# Altium project StationSolPortative.PrjPcb
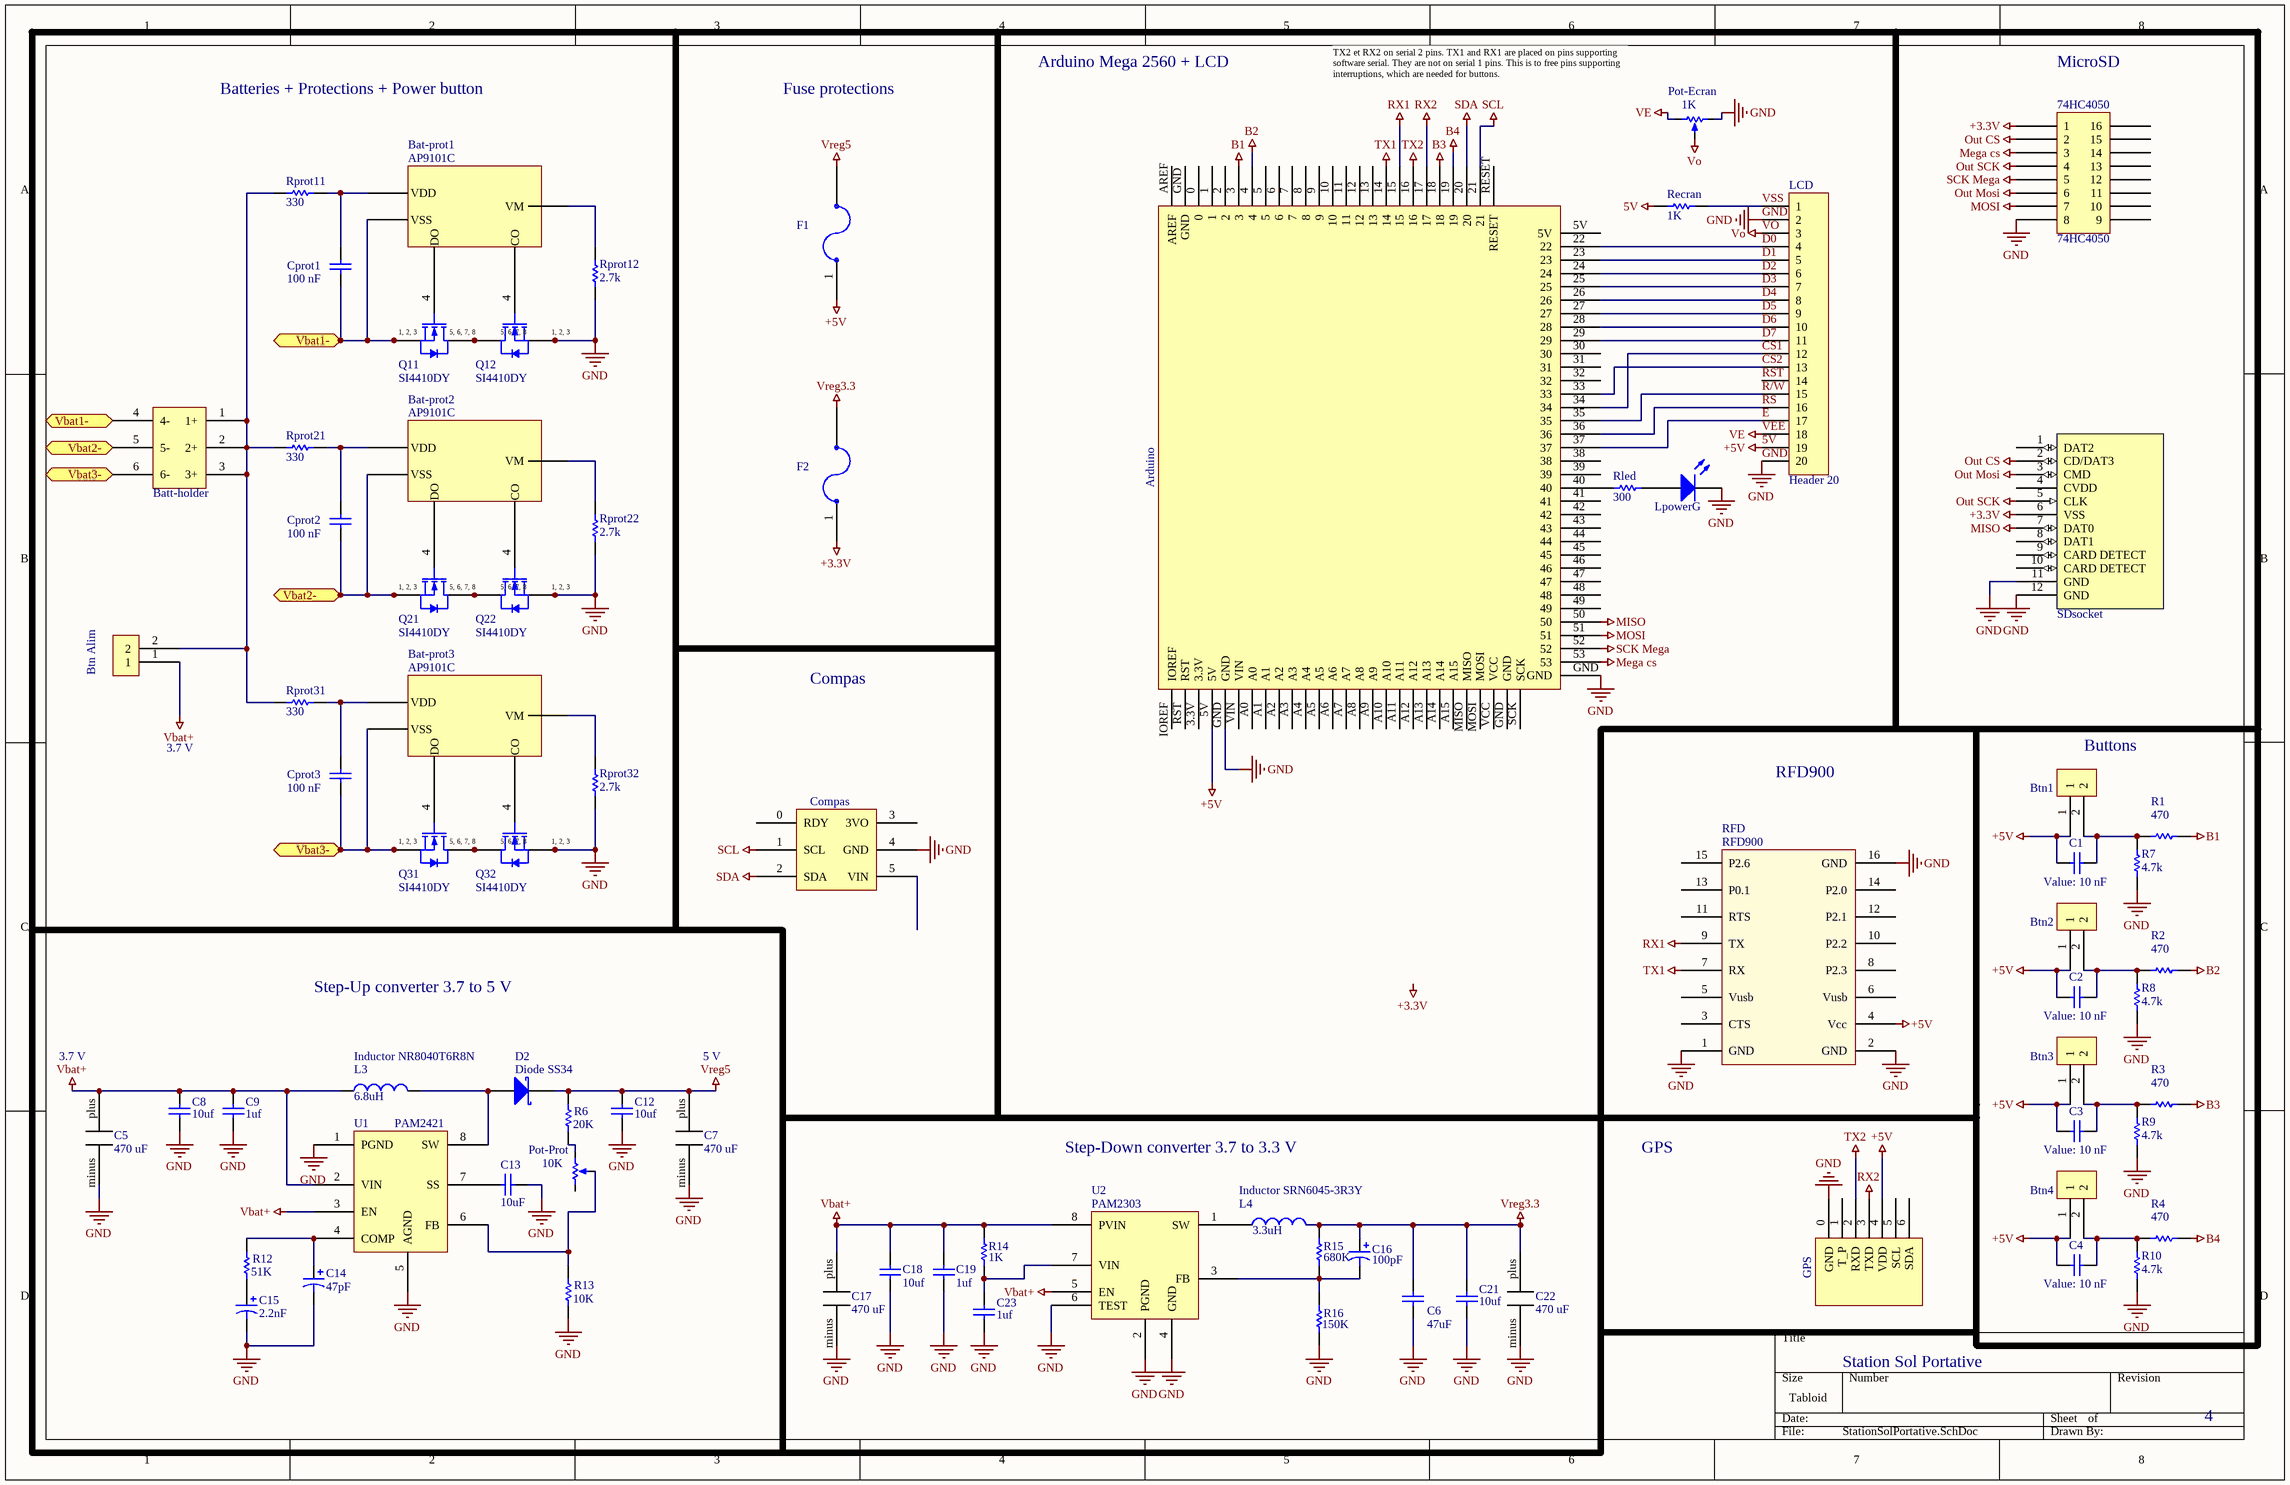
[diagram p0: StationSolPortative.SchDoc]
1 sheet, 77 parts. Net scope: flat (ports and power ports of the same name join across sheets).
Board file: StationSolPortative.PcbDoc

## Sheet StationSolPortative.SchDoc
size Tabloid

### Parts
74HC4050  74HC4050  [DIP16_74HC4050]
Arduino  ArduinoMega2560  [ArduinoMega2560]  (value not drawn)
Bat-prot1  AP9101C  [SOT26]
Bat-prot2  AP9101C  [SOT26]
Bat-prot3  AP9101C  [SOT26]
Batt-holder  BH-BK-18650-PC6-ND  [BH-BK-18650-PC6-ND]  (value not drawn)
Btn1  MAT100_2PINS  [MTA100_2PINS]  (value not drawn)
Btn2  MAT100_2PINS  [MTA100_2PINS]  (value not drawn)
Btn3  MAT100_2PINS  [MTA100_2PINS]  (value not drawn)
Btn4  MAT100_2PINS  [MTA100_2PINS]  (value not drawn)
Btn_Alim  MAT100_2PINS  [MTA100_2PINS]  (value not drawn)
C1  10 nF  [CAP 0805 - N]
C2  10 nF  [CAP 0805 - N]
C3  10 nF  [CAP 0805 - N]
C4  10 nF  [CAP 0805 - N]
C5  470 uF  [Gros condensateur]
C6  value 47uF  [C1210]  (hidden comment: Cap Semi)
C7  470 uF  [Gros condensateur]
C8  10uf  [CAP 0805 - N]
C9  1uf  [CAP 0805 - N]
C12  10uf  [CAP 0805 - N]
C13  10uF  [CAP 0805 - N]
C14  value 47pF  [CAP 0805 - N]  (hidden comment: Cap Pol1)
C15  value 2.2nF  [CAP 0805 - N]  (hidden comment: Cap Pol1)
C16  value 100pF  [CAP 0805 - N]  (hidden comment: Cap Pol1)
C17  470 uF  [Gros condensateur]
C18  10uf  [CAP 0805 - N]
C19  1uf  [CAP 0805 - N]
C21  10uf  [CAP 0805 - N]
C22  470 uF  [Gros condensateur]
C23  1uf  [CAP 0805 - N]
Compas  HMC5883L  [HMC5883L]  (value not drawn)
Cprot1  100 nF  [CAP 0805 - N]
Cprot2  100 nF  [CAP 0805 - N]
Cprot3  100 nF  [CAP 0805 - N]
D2  Diode SS34  [Diode]
F1  Fuse  [Fuse Holder 3mm]  (value not drawn)
F2  Fuse  [Fuse Holder 3mm]  (value not drawn)
gps  GPS  [PAM-7Q GPS]
L3  Inductor NR8040T6R8N  value 6.8uH  [Inductance 6.8uH]
L4  Inductor SRN6045-3R3Y  value 3.3uH  [Inductance]
LCD  Header 20  [HDR2X10]
LpowerG  LED 1206  [LED - 1206]  (value not drawn)
Pot-Ecran  value 1K  [Trim 67WR]  (hidden comment: Res Pot)
Pot-Prot  value 10K  [Trim 67WR]  (hidden comment: Res Pot)
Q11  SI4410DY  [SO-8_N]
Q12  SI4410DY  [SO-8_N]
Q21  SI4410DY  [SO-8_N]
Q22  SI4410DY  [SO-8_N]
Q31  SI4410DY  [SO-8_N]
Q32  SI4410DY  [SO-8_N]
R1  value 470  [Res 0805 - N]  (hidden comment: Res smd)
R2  value 470  [Res 0805 - N]  (hidden comment: Res smd)
R3  value 470  [Res 0805 - N]  (hidden comment: Res smd)
R4  value 470  [Res 0805 - N]  (hidden comment: Res smd)
R6  value 20K  [Res 0805 - N]  (hidden comment: Res1)
R7  value 4.7k  [Res 0805 - N]  (hidden comment: Res smd)
R8  value 4.7k  [Res 0805 - N]  (hidden comment: Res smd)
R9  value 4.7k  [Res 0805 - N]  (hidden comment: Res smd)
R10  value 4.7k  [Res 0805 - N]  (hidden comment: Res smd)
R12  value 51K  [Res 0805 - N]  (hidden comment: Res1)
R13  value 10K  [Res 0805 - N]  (hidden comment: Res1)
R14  value 1K  [Res 0805 - N]  (hidden comment: Res1)
R15  value 680K  [Res 0805 - N]  (hidden comment: Res1)
R16  value 150K  [Res 0805 - N]  (hidden comment: Res1)
Recran  value 1K  [Res 0805 - N]  (hidden comment: Res smd)
RFD  Component_1  [RFD900]  (value not drawn)
Rled  value 300  [Res 0805 - N]  (hidden comment: Res smd)
Rprot11  value 330  [Res 0805 - N]  (hidden comment: Res smd)
Rprot12  value 2.7k  [Res 0805 - N]  (hidden comment: Res smd)
Rprot21  value 330  [Res 0805 - N]  (hidden comment: Res smd)
Rprot22  value 2.7k  [Res 0805 - N]  (hidden comment: Res smd)
Rprot31  value 330  [Res 0805 - N]  (hidden comment: Res smd)
Rprot32  value 2.7k  [Res 0805 - N]  (hidden comment: Res smd)
SDsocket  Carte micro SD  [Carte SD]  (value not drawn)
U1  PAM2421  [SOP8]
U2  Name: PAM2303  [SOP8]  (hidden comment: PAM2320)

### Blocks framed on the sheet
Batteries + Protections + Power button: Bat-prot1-Bat-prot3 Batt-holder Btn_Alim Cprot1-Cprot3 Q11 Q12 Q21 Q22 Q31 Q32 Rprot11 Rprot12 Rprot21 Rprot22 Rprot31 Rprot32
Fuse protections: F1 F2
MicroSD: 74HC4050 SDsocket
RFD900: RFD
Buttons: Btn1-Btn4 C1-C4 R1-R4 R7-R10
Step-Up converter 3.7 to 5 V: C5 C7-C9 C12-C15 D2 L3 Pot-Prot R6 R12 R13 U1
Step-Down converter 3.7 to 3.3 V: C6 C16-C19 C21-C23 L4 R14-R16 U2

### Ports
Vbat1-, Vbat2-, Vbat3-

### Nets
5V: Arduino.5V Btn1.1 Btn2.1 Btn3.1 Btn4.1 C1.1 C2.1 C3.1 C4.1 F1.1 gps.4(VDD) LCD.19 Recran.1 RFD.4(Vcc)  [also labelled +5V]
+3.3V: 74HC4050.1 F2.1 SDsocket.6(VSS)
B1: Arduino.3 R1.1
B2: Arduino.4 R2.1
B3: Arduino.18 R3.1
B4: Arduino.19 R4.1
GND: 74HC4050.8 Arduino.GND C5.minus C6.1 C7.minus C8.1 C9.1 C12.1 C13.1 C14.2 C15.2 C17.minus C18.1 C19.1 C21.1 C22.minus C23.1 Compas.4(GND) gps.0(GND) LCD.2 LCD.20 LpowerG.2 Pot-Ecran.3(Bot) Q12.1(S) Q12.2(S) Q12.3(S) Q22.1(S) Q22.2(S) Q22.3(S) Q32.1(S) Q32.2(S) Q32.3(S) R7.1 R8.1 R9.1 R10.1 R13.1 R16.1 RFD.1(GND) RFD.2(GND) RFD.16(GND) Rprot12.1 Rprot22.1 Rprot32.1 SDsocket.11(GND) SDsocket.12(GND) U1.1(PGND) U1.5(AGND) U2.2(PGND) U2.4(GND) U2.6(TEST)
Mega cs: 74HC4050.3 Arduino.53
MISO: Arduino.50 SDsocket.7(DAT0)
MOSI: 74HC4050.7 Arduino.51
Out CS: 74HC4050.2 SDsocket.2(CD/DAT3)
Out Mosi: 74HC4050.6 SDsocket.3(CMD)
Out SCK: 74HC4050.4 SDsocket.5(CLK)
RX1: Arduino.15 RFD.9(TX)
RX2: Arduino.17 gps.3(TXD)
SCK Mega: 74HC4050.5 Arduino.52
SCL: Arduino.21 Compas.1(SCL)
SDA: Arduino.20 Compas.2(SDA)
TX1: Arduino.14 RFD.7(RX)
TX2: Arduino.16 gps.2(RXD)
Vbat+: Btn_Alim.1 C5.plus C8.2 C9.2 C17.plus C18.2 C19.2 L3.1 R14.2 U1.2(VIN) U1.3(EN) U2.5(EN) U2.8(PVIN)
VEE: LCD.18 Pot-Ecran.1(Top)  [also labelled VE]
VO: LCD.3 Pot-Ecran.2(Tap)
Vreg3.3: C6.2 C16.1 C21.2 C22.plus F2.2 L4.2 R15.2
Vreg5: C7.plus C12.2 D2.1(K) F1.2 R6.2
CS1: Arduino.34 LCD.12
CS2: Arduino.33 LCD.13
D0: Arduino.22 LCD.4
D1: Arduino.23 LCD.5
D2: Arduino.24 LCD.6
D3: Arduino.25 LCD.7
D4: Arduino.26 LCD.8
D5: Arduino.27 LCD.9
D6: Arduino.28 LCD.10
D7: Arduino.29 LCD.11
E: Arduino.37 LCD.17
R/W: Arduino.35 LCD.15
RS: Arduino.36 LCD.16
RST: LCD.14
VSS: LCD.1 Recran.2
NetArduino_40: Arduino.40 Rled.1
NetBat-prot1_CO: Bat-prot1.CO Q12.4(G)
NetBat-prot1_DO: Bat-prot1.DO Q11.4(G)
NetBat-prot1_VDD: Bat-prot1.VDD Cprot1.2 Rprot11.2
NetBat-prot1_VM: Bat-prot1.VM Rprot12.2
NetBat-prot1_VSS: Bat-prot1.VSS Batt-holder.4(4-) Cprot1.1 Q11.1(S) Q11.2(S) Q11.3(S) ; port Vbat1-
NetBat-prot2_CO: Bat-prot2.CO Q22.4(G)
NetBat-prot2_DO: Bat-prot2.DO Q21.4(G)
NetBat-prot2_VDD: Bat-prot2.VDD Cprot2.2 Rprot21.2
NetBat-prot2_VM: Bat-prot2.VM Rprot22.2
NetBat-prot2_VSS: Bat-prot2.VSS Batt-holder.5(5-) Cprot2.1 Q21.1(S) Q21.2(S) Q21.3(S) ; port Vbat2-
NetBat-prot3_CO: Bat-prot3.CO Q32.4(G)
NetBat-prot3_DO: Bat-prot3.DO Q31.4(G)
NetBat-prot3_VDD: Bat-prot3.VDD Cprot3.2 Rprot31.2
NetBat-prot3_VM: Bat-prot3.VM Rprot32.2
NetBat-prot3_VSS: Bat-prot3.VSS Batt-holder.6(6-) Cprot3.1 Q31.1(S) Q31.2(S) Q31.3(S) ; port Vbat3-
NetBatt-holder_1: Batt-holder.1(1+) Batt-holder.2(2+) Batt-holder.3(3+) Btn_Alim.2 Rprot11.1 Rprot21.1 Rprot31.1
NetBtn1_2: Btn1.2 C1.2 R1.2 R7.2
NetBtn2_2: Btn2.2 C2.2 R2.2 R8.2
NetBtn3_2: Btn3.2 C3.2 R3.2 R9.2
NetBtn4_2: Btn4.2 C4.2 R4.2 R10.2
NetC13_2: C13.2 U1.7(SS)
NetC14_1: C14.1 R12.2 U1.4(COMP)
NetC15_1: C15.1 R12.1
NetC16_2: C16.2 R15.1 R16.2 U2.3(FB)
NetC23_2: C23.2 R14.1 U2.7(VIN)
NetD2_3: D2.3(A) L3.2 U1.8(SW)
NetL4_1: L4.1 U2.1(SW)
NetLpowerG_1: LpowerG.1 Rled.2
NetPot-Prot_2: Pot-Prot.2(Tap) R13.2 U1.6(FB)
NetPot-Prot_3: Pot-Prot.3(Bot) R6.1
NetQ11_5: Q11.5(D) Q11.6(D) Q11.7(D) Q11.8(D) Q12.5(D) Q12.6(D) Q12.7(D) Q12.8(D)
NetQ21_5: Q21.5(D) Q21.6(D) Q21.7(D) Q21.8(D) Q22.5(D) Q22.6(D) Q22.7(D) Q22.8(D)
NetQ31_5: Q31.5(D) Q31.6(D) Q31.7(D) Q31.8(D) Q32.5(D) Q32.6(D) Q32.7(D) Q32.8(D)

Not connected (* = marked no-connect by the designer): 74HC4050 9 10 11 12 13 14 15 16; Arduino 0 1 2 3.3V 5 6 7 8 9 10 11 12 13 30 31 32 38 39 41 42 43 44 45 46 47 48 49 A0 A1 A2 A3 A4 A5 A6 A7 A8 A9 A10 A11 A12 A13 A14 A15 AREF IOREF MISO MOSI RESET RST SCK VCC VIN; Compas 0(RDY) 3(3VO) 5(VIN); gps 1(T_P) 5(SCL) 6(SDA); Pot-Prot 1(Top); RFD 3(CTS) 5(Vusb) 6(Vusb) 8(P2.3) 10(P2.2) 11(RTS) 12(P2.1) 13(P0.1) 14(P2.0) 15(P2.6); SDsocket 1(DAT2) 4(CVDD) 8(DAT1) 9(CARD_DETECT) 10(CARD_DETECT)

### Notes on the sheet
- Arduino Mega 2560 + LCD
- TX2 et RX2 on serial 2 pins. TX1 and RX1 are placed on pins supporting software serial. They are not on serial 1 pins. This is to free pins supporting interruptions, which are needed for buttons.
- Compas
- 3.7 V
- 5 V
- GPS
- Station Sol Portative
- 4
- Labels drawn without touching a wire or pin: +3.3V
- (in symbol Component_1) RFD900
- (in symbol SI4410DY) 1, 2, 3; 5, 6, 7, 8

### Library data of the parts
Bat-prot1-Bat-prot3 = AP9101C: pin to pad: CO>3 DO>1 VDD>5 VM>2 VSS>6; NAME: AP9101C
C1-C4 = Condensateur smd: Value: 10 nF
C5 C7 C17 C22 = Gros condensateur
C6 = Cap Semi: Capacitor (Semiconductor SIM Model); Published: 8-Jun-2000; LatestRevisionDate: 29-May-2009; LatestRevisionNote: IPC-7351 Footprint Added.; PackageReference: C1206; Publisher: Altium Limited; PackageDescription: Chip Capacitor
C8 C9 C12 C13 C18 C19 C21 C23 Cprot1-Cprot3 = Condensateur smd: Value: 5 pF
C14-C16 = Cap Pol1: Polarized Capacitor (Radial); Published: 8-Jun-2000; LatestRevisionDate: 17-Jul-2002; LatestRevisionNote: Re-released for DXP Platform.; PackageReference: RB7.6-15; Publisher: Altium Limited; PackageDescription: Polarized Capacitor (Radial); 2 Leads
Compas = HMC5883L: Compass
D2 = Diode 10TQ035: Schottky Rectifier; Note: Terminal 2 is the TAB and is electrically connected to the cathode; Published: 8-Jun-2000; LatestRevisionDate: 17-Jul-2002; LatestRevisionNote: Re-released for DXP Platform.; DatasheetVersion: PD-2.057B; PackageVersion: Feb-1998; PackageReference: TO-220AC; Publisher: Altium Limited; PackageDescription: TO, Thru-Hole, Vertical, Heatsink Mounted; 3 In-Line Leads (1 Absent); Pitch 2.54 mm; ComponentLink1Description: Manufacturer Link; ComponentLink1URL: http://www.irf.com/; ComponentLink2Description: Datasheet; ComponentLink2URL: http://www.irf.com/product-info/datasheets/data/10tq.pdf
gps = Pam-Q7 GPS
L3 L4 = Inductor: Code_IEC: 1005; Published: 8-Jun-2000; LatestRevisionDate: 29-May-2009; LatestRevisionNote: IPC-7351 Footprint Added.; PackageReference: 0402-A; Publisher: Altium Limited; PackageDescription: Chip Inductor; Code_JEITA: 0402
LCD = Header 20: Header, 20-Pin; LatestRevisionDate: 17-Jul-2002; LatestRevisionNote: Re-released for DXP Platform.; Publisher: Altium Limited
LpowerG = LED: Color: Green
Pot-Ecran Pot-Prot = Res Pot: Resistor Trimmer
Q11 Q12 Q21 Q22 Q31 Q32 = SI4410DY: N-Channel 30V (D-S)  MOSFET; Published: 8-Jun-2000; LatestRevisionDate: 13-Apr-2006; LatestRevisionNote: IPC-7351 Footprint Added.; DatasheetVersion: 23-Nov-1998; PackageVersion: Aug-1998; PackageReference: SO-8; Publisher: Altium Limited; PackageDescription: 8-Pin Small Outline Integrated Circuit 1.27 mm Pitch; ComponentLink1Description: Manufacturer Link; ComponentLink1URL: http://www.vishay.com/; ComponentLink2Description: Datasheet; ComponentLink2URL: http://www.vishay.com/docs/71726/71726.pdf
R6 R12-R16 = Res1: Resistor; Published: 8-Jun-2000; LatestRevisionDate: 17-Jul-2002; LatestRevisionNote: Re-released for DXP Platform.; PackageReference: AXIAL-0.3; Publisher: Altium Limited; PackageDescription: Axial Device, Thru-Hole; 2 Leads; 0.3 in Pin Spacing
SDsocket = Carte SD
U1 = PAM2421: 3A PWM STEP-UP DC-DC CONVERTER
U2 = PAM2320: 3A LOW NOISE STEP-DOWN DC-DC CONVERTER